# Altium schematic sheet 1WB_DS2406_EPROM.SchDoc: 1-Wire Bus ID
size A4; Revision: 5; SheetNumber: 12; SheetTotal: 12; Organization: Altium Limited.; Address1: Level 3, 12a Rodborough Rd; Address2: Frenchs Forest 2086; Address3: NSW; Address4: AUSTRALIA
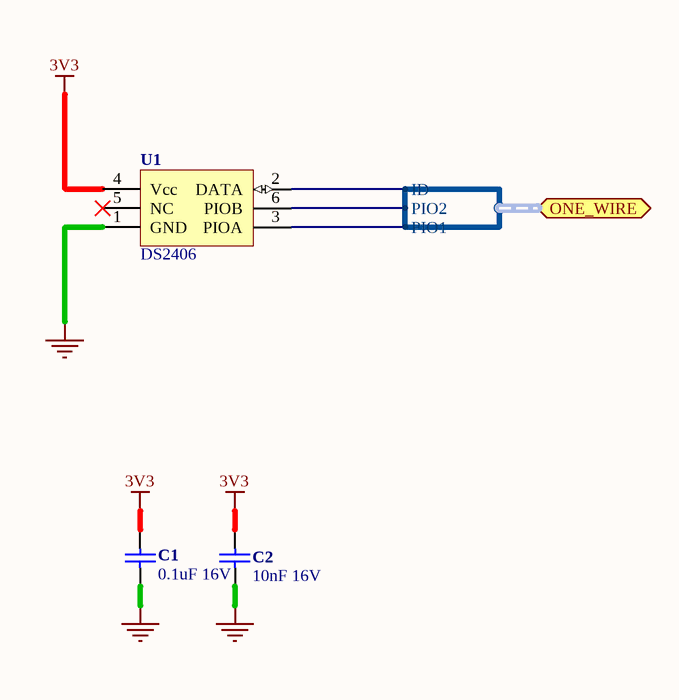
[diagram p0: 1WB_DS2406_EPROM.SchDoc]

## Parts
C1  0.1uF 16V  [CAPC1005-STAR]
C2  10nF 16V  [CAPC1005-STAR]
U1  DS2406  [TSOC6]

## Ports
ONE_WIRE (harness ONE_WIRE)

## Harnesses
ONE_WIRE: ID, PIO2, PIO1

## Nets
3V3: C1.2 C2.1 U1.4(Vcc)
GND: C1.1 C2.2 U1.1(GND)
NetU1_2: U1.2(DATA) ; port ONE_WIRE.ID
NetU1_3: U1.3(PIOA) ; port ONE_WIRE.PIO1
NetU1_6: U1.6(PIOB) ; port ONE_WIRE.PIO2

Not connected (* = marked no-connect by the designer): U1 5(NC)*

## Notes on the sheet
- Sheet Title
- Project Title
- Size:
- Date:
- A4
- Assy:
- Time:
- Sheet
- Revision:
- of
- File:

## Library data of the parts
C1 = D-101-0080: Capacitor, Ceramic, 0.1uF 10% 16V 0402 (1005) X7R; Polarity: Non-Polarized; Capacitance: 0.1 uF; Category: Capacitor; Dielectric: X7R; Mounting Technology: Surface Mount; Rated Voltage: 16 V; Status: Production; Technology: Ceramic; Tolerance: 10 %
C2 = D-101-0077: Capacitor, Ceramic, 10nF 10% 16V 0402 (1005) X7R; Polarity: Non-Polarized; Capacitance: 10 nF; Category: Capacitor; Dielectric: X7R; Mounting Technology: Surface Mount; Rated Voltage: 16 V; Status: Production; Technology: Ceramic; Tolerance: 10 %
U1 = D-263-0002: Dual Addressable Switch Plus 1KB Memory; Bit Length: Bits; Speed: ps; Supply Voltage: mV; Bit Width: Bits; Mounting Technology: Surface Mount; Status: Unreleased; Technology: None; Category: IC-PROM